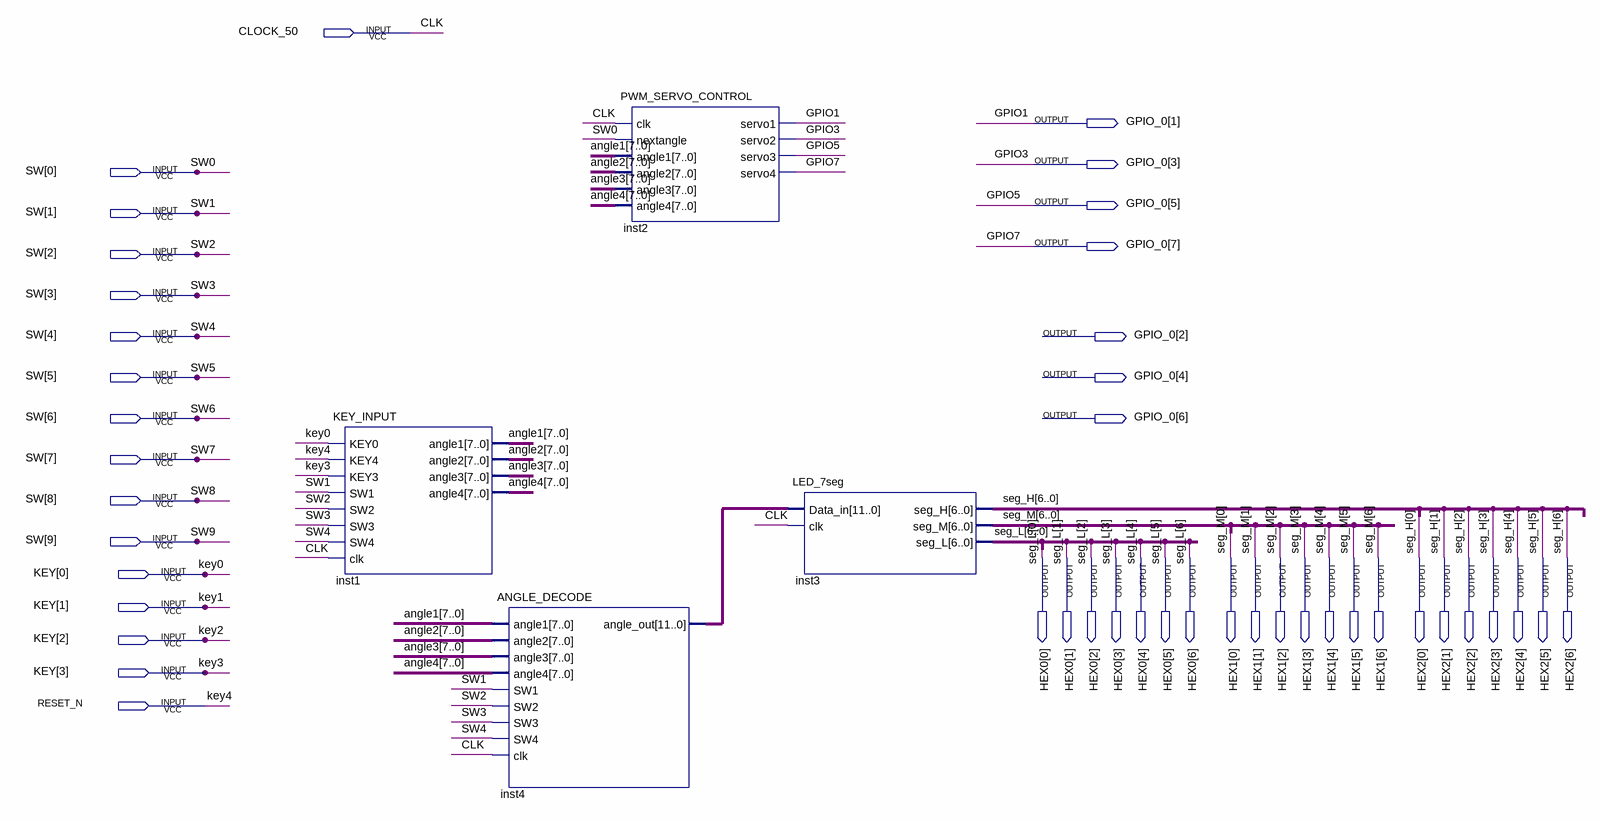
[diagram p0: schematic sheet]
// Quartus schematic Top.bdf as structural Verilog: 4 symbols, 44 pins
module Top (
  input  CLOCK_50,
  input  [9:0] SW,
  input  [3:0] KEY,
  input  RESET_N,
  output [7:1] GPIO_0,
  output [6:0] HEX0,
  output [6:0] HEX1,
  output [6:0] HEX2
);

  wire [7:0] angle1, angle2, angle3, angle4;
  wire [11:0] inst4_angle_out;

  KEY_INPUT inst1 (
    .KEY0(KEY[0]), .KEY4(RESET_N), .KEY3(KEY[3]), .SW1(SW[1]), .SW2(SW[2]), .SW3(SW[3]), .SW4(SW[4]),
    .clk(CLOCK_50), .angle1(angle1), .angle2(angle2), .angle3(angle3), .angle4(angle4));
  ANGLE_DECODE inst4 (
    .angle1(angle1), .angle2(angle2), .angle3(angle3), .angle4(angle4), .SW1(SW[1]), .SW2(SW[2]),
    .SW3(SW[3]), .SW4(SW[4]), .clk(CLOCK_50), .angle_out(inst4_angle_out));
  PWM_SERVO_CONTROL inst2 (
    .clk(CLOCK_50), .nextangle(SW[0]), .angle1(angle1), .angle2(angle2), .angle3(angle3), .angle4(angle4),
    .servo1(GPIO_0[1]), .servo2(GPIO_0[3]), .servo3(GPIO_0[5]), .servo4(GPIO_0[7]));
  LED_7seg inst3 (.Data_in(inst4_angle_out), .clk(CLOCK_50), .seg_H(HEX2), .seg_M(HEX1), .seg_L(HEX0));

  // Other names for the same wires on the sheet: CLK = CLOCK_50; GPIO1 = GPIO_0[1]; GPIO3 = GPIO_0[3];
  //   GPIO5 = GPIO_0[5]; GPIO7 = GPIO_0[7]; key4 = RESET_N; seg_H[6:0] = HEX2; seg_L[6:0] = HEX0; seg_M[6:0] = HEX1
endmodule
